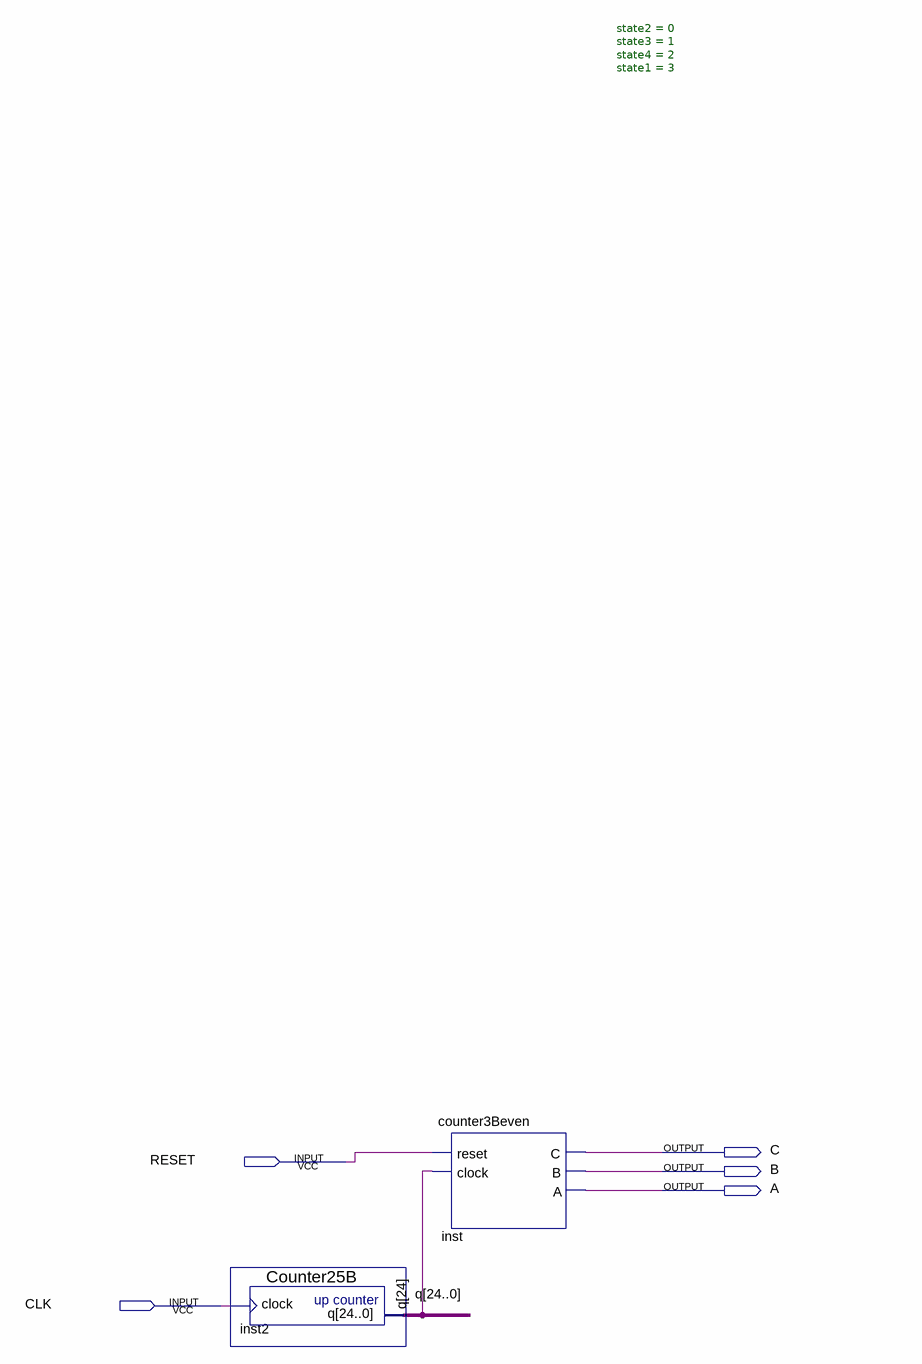
[diagram p0: schematic sheet]
// Quartus schematic TB2.bdf as structural Verilog: 2 symbols, 5 pins
module TB2 (
  input  RESET,
  input  CLK,
  output C,
  output B,
  output A
);

  wire [24:0] q;

  Counter25B inst2 (.clock(CLK), .q(q));
  counter3Beven #(.state2(0), .state3(1), .state4(2), .state1(3)) inst (
    .reset(RESET), .clock(q[24]), .C(C), .B(B), .A(A));
endmodule
